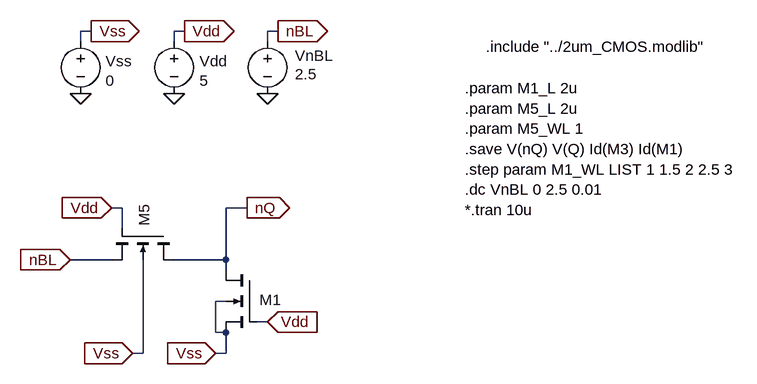
[diagram p0: schematic BL-discharge.asc]
BL-discharge.asc, the LTspice schematic file:
Version 4
SHEET 1 1180 1172
WIRE -608 -80 -624 -80
WIRE -464 -80 -480 -80
WIRE -320 -80 -336 -80
WIRE -624 -64 -624 -80
WIRE -480 -64 -480 -80
WIRE -336 -64 -336 -80
WIRE -560 192 -576 192
WIRE -368 192 -400 192
WIRE -560 224 -560 192
WIRE -576 272 -640 272
WIRE -400 272 -400 192
WIRE -400 272 -480 272
WIRE -400 288 -400 272
WIRE -400 336 -416 336
WIRE -336 368 -352 368
WIRE -416 384 -416 336
WIRE -400 384 -416 384
WIRE -528 416 -528 272
WIRE -528 416 -544 416
WIRE -400 416 -400 384
WIRE -400 416 -416 416
FLAG -480 16 0
FLAG -464 -80 Vdd
IOPIN -464 -80 Out
FLAG -336 16 0
FLAG -320 -80 nBL
IOPIN -320 -80 Out
FLAG -416 416 Vss
IOPIN -416 416 In
FLAG -640 272 nBL
IOPIN -640 272 In
FLAG -624 16 0
FLAG -608 -80 Vss
IOPIN -608 -80 Out
FLAG -336 368 Vdd
IOPIN -336 368 In
FLAG -576 192 Vdd
IOPIN -576 192 In
FLAG -368 192 nQ
IOPIN -368 192 Out
FLAG -544 416 Vss
IOPIN -544 416 In
SYMBOL nmos4 -352 288 M0
WINDOW 0 -37 46 Left 2
WINDOW 3 -70 42 Invisible 2
SYMATTR InstName M1
SYMATTR Value N_2u
SYMATTR Value2 l=M1_L w={M1_L*M1_WL}
SYMBOL voltage -480 -80 R0
WINDOW 0 39 46 Left 2
WINDOW 3 39 76 Left 2
SYMATTR InstName Vdd
SYMATTR Value 5
SYMBOL voltage -336 -80 R0
WINDOW 0 42 38 Left 2
WINDOW 3 42 66 Left 2
WINDOW 123 0 0 Left 0
WINDOW 39 0 0 Left 0
SYMATTR InstName VnBL
SYMATTR Value 2.5
SYMBOL nmos4 -480 224 R90
WINDOW 0 -37 46 Left 2
WINDOW 3 -70 42 Invisible 2
SYMATTR InstName M5
SYMATTR Value N_2u
SYMATTR Value2 l={M5_L} w={M5_L*M5_WL}
SYMBOL voltage -624 -80 R0
WINDOW 0 39 46 Left 2
WINDOW 3 39 76 Left 2
SYMATTR InstName Vss
SYMATTR Value 0
TEXT 0 -56 Left 2 !.include "../2um_CMOS.modlib"
TEXT -32 8 Left 2 !.param M1_L 2u\n.param M5_L 2u\n.param M5_WL 1\n.save V(nQ) V(Q) Id(M3) Id(M1)\n.step param M1_WL LIST 1 1.5 2 2.5 3\n.dc VnBL 0 2.5 0.01\n*.tran 10u

The netlist it stands for:
* BL-discharge.asc
M1 nQ Vdd Vss Vss N_2u l=M1_L w={M1_L*M1_WL}
Vdd Vdd 0 5
VnBL nBL 0 2.5
M5 nQ Vdd nBL Vss N_2u l={M5_L} w={M5_L*M5_WL}
Vss Vss 0 0
.model NMOS NMOS
.model PMOS PMOS
.lib standard.mos
.include "../2um_CMOS.modlib"
.param M1_L 2u
.param M5_L 2u
.param M5_WL 1
.save V(nQ) V(Q) Id(M3) Id(M1)
.step param M1_WL LIST 1 1.5 2 2.5 3
.dc VnBL 0 2.5 0.01
*.tran 10u
.backanno
.end